# Altium project IOT_BOARD_SIM4G.PrjPcb
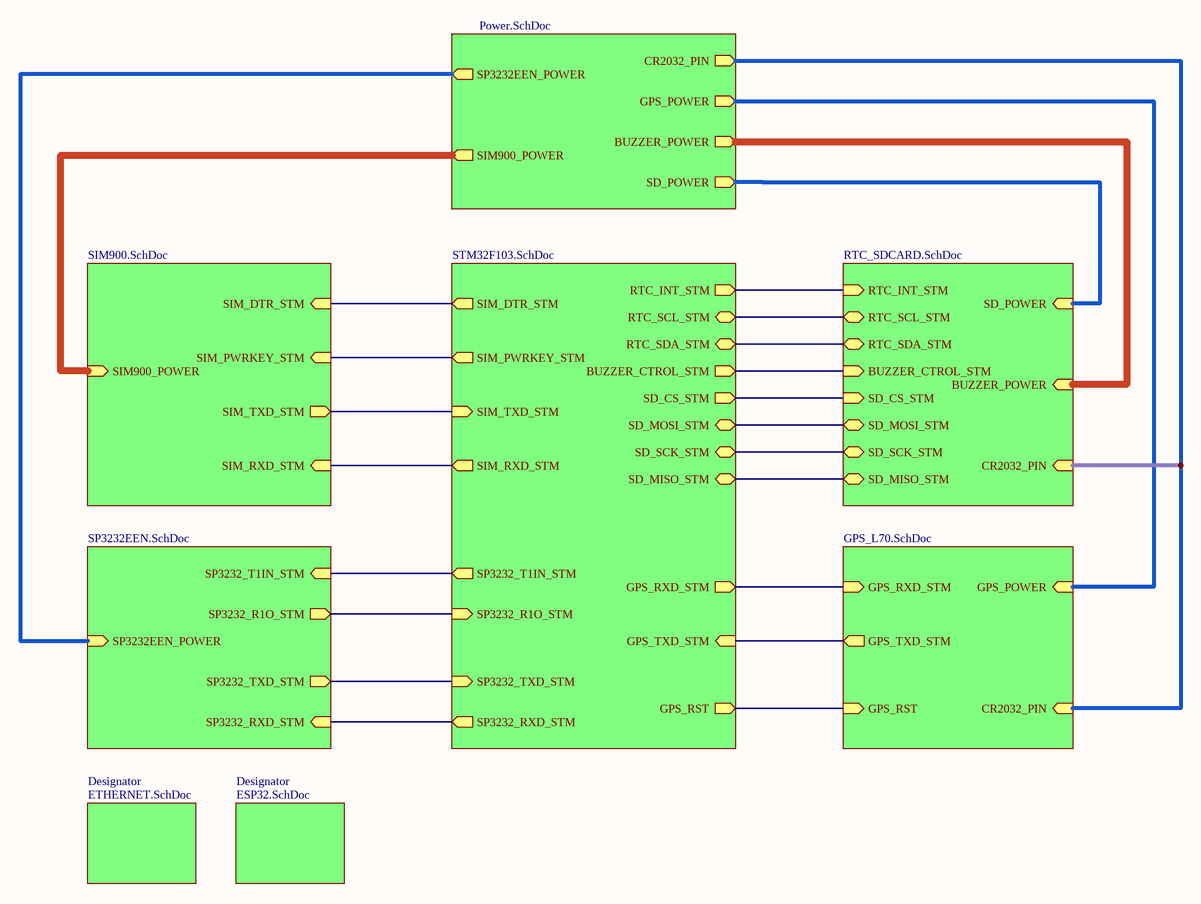
[diagram p0: IOT_4G_BOARD.SchDoc]
9 sheets, 112 parts. Net scope: hierarchical (ports join the sheet entries above them; power ports are global).
Board file: IOT_BOARD_SIM4G.PcbDoc
Sheets:
  IOT_4G_BOARD.SchDoc
    Designator = SIM900.SchDoc
    Designator = SP3232EEN.SchDoc
    Designator = STM32F103.SchDoc
    Designator = RTC_SDCARD.SchDoc
    Designator = GPS_L70.SchDoc
    Designator = Power.SchDoc
    Designator = ETHERNET.SchDoc
    Designator = ESP32.SchDoc

## Sheet IOT_4G_BOARD.SchDoc
size A3; SheetNumber: 1; SheetTotal: 9

### Sub-sheets
Designator = SIM900.SchDoc: SIM900_POWER (in), SIM_RXD_STM (in), SIM_DTR_STM (in), SIM_TXD_STM (out), SIM_PWRKEY_STM (in)
Designator = SP3232EEN.SchDoc: SP3232EEN_POWER (in), SP3232_T1IN_STM (in), SP3232_R1O_STM (out), SP3232_TXD_STM (out), SP3232_RXD_STM (in)
Designator = STM32F103.SchDoc: SIM_RXD_STM (out), SIM_DTR_STM (out), SIM_TXD_STM (in), SP3232_T1IN_STM (out), SP3232_R1O_STM (in), SP3232_TXD_STM (in), SP3232_RXD_STM (out), RTC_SDA_STM (bidir), BUZZER_CTROL_STM (out), SD_CS_STM (out), SD_MOSI_STM (bidir), SD_SCK_STM (bidir), SD_MISO_STM (bidir), RTC_SCL_STM (bidir), RTC_INT_STM (out), GPS_RXD_STM (out), GPS_TXD_STM (in), GPS_RST (out), SIM_PWRKEY_STM (out)
Designator = RTC_SDCARD.SchDoc: CR2032_PIN (in), BUZZER_POWER (in), SD_POWER (in), RTC_SDA_STM (bidir), BUZZER_CTROL_STM (in), SD_CS_STM (in), SD_MOSI_STM (bidir), SD_SCK_STM (bidir), SD_MISO_STM (bidir), RTC_SCL_STM (bidir), RTC_INT_STM (in)
Designator = GPS_L70.SchDoc: GPS_POWER (in), CR2032_PIN (in), GPS_RXD_STM (in), GPS_TXD_STM (out), GPS_RST (in)
Designator = Power.SchDoc: CR2032_PIN (out), GPS_POWER (out), BUZZER_POWER (out), SD_POWER (out), SP3232EEN_POWER (out), SIM900_POWER (out)
Designator = ETHERNET.SchDoc: no entries
Designator = ESP32.SchDoc: no entries

### Nets
POWER: sheet Designator/SP3232EEN_POWER, sheet Designator/SD_POWER, sheet Designator/GPS_POWER, sheet Designator/GPS_POWER, sheet Designator/SD_POWER, sheet Designator/SP3232EEN_POWER
VBAT: sheet Designator/SIM900_POWER, sheet Designator/BUZZER_POWER, sheet Designator/BUZZER_POWER, sheet Designator/SIM900_POWER
9: sheet Designator/SP3232_TXD_STM, sheet Designator/SP3232_TXD_STM
10: sheet Designator/SP3232_RXD_STM, sheet Designator/SP3232_RXD_STM
11: sheet Designator/SP3232_T1IN_STM, sheet Designator/SP3232_T1IN_STM
12: sheet Designator/SP3232_R1O_STM, sheet Designator/SP3232_R1O_STM
NetC23_2: sheet Designator/CR2032_PIN, sheet Designator/CR2032_PIN, sheet Designator/CR2032_PIN
NetM1_3: sheet Designator/SIM_DTR_STM, sheet Designator/SIM_DTR_STM
NetM1_9: sheet Designator/SIM_TXD_STM, sheet Designator/SIM_TXD_STM
NetM1_10: sheet Designator/SIM_RXD_STM, sheet Designator/SIM_RXD_STM
NetMMC1_2: sheet Designator/SD_CS_STM, sheet Designator/SD_CS_STM
NetMMC1_3: sheet Designator/SD_MOSI_STM, sheet Designator/SD_MOSI_STM
NetMMC1_5: sheet Designator/SD_SCK_STM, sheet Designator/SD_SCK_STM
NetMMC1_7: sheet Designator/SD_MISO_STM, sheet Designator/SD_MISO_STM
NetR1_1: sheet Designator/SIM_PWRKEY_STM, sheet Designator/SIM_PWRKEY_STM
NetR15_2: sheet Designator/BUZZER_CTROL_STM, sheet Designator/BUZZER_CTROL_STM
NetR18_1: sheet Designator/GPS_RST, sheet Designator/GPS_RST
NetU3_68: sheet Designator/GPS_RXD_STM, sheet Designator/GPS_RXD_STM
NetU3_69: sheet Designator/GPS_TXD_STM, sheet Designator/GPS_TXD_STM
NetU3_91: sheet Designator/RTC_INT_STM, sheet Designator/RTC_INT_STM
NetU3_92: sheet Designator/RTC_SCL_STM, sheet Designator/RTC_SCL_STM
NetU3_93: sheet Designator/RTC_SDA_STM, sheet Designator/RTC_SDA_STM

## Sheet SIM900.SchDoc
size A; SheetNumber: 2; SheetTotal: 9
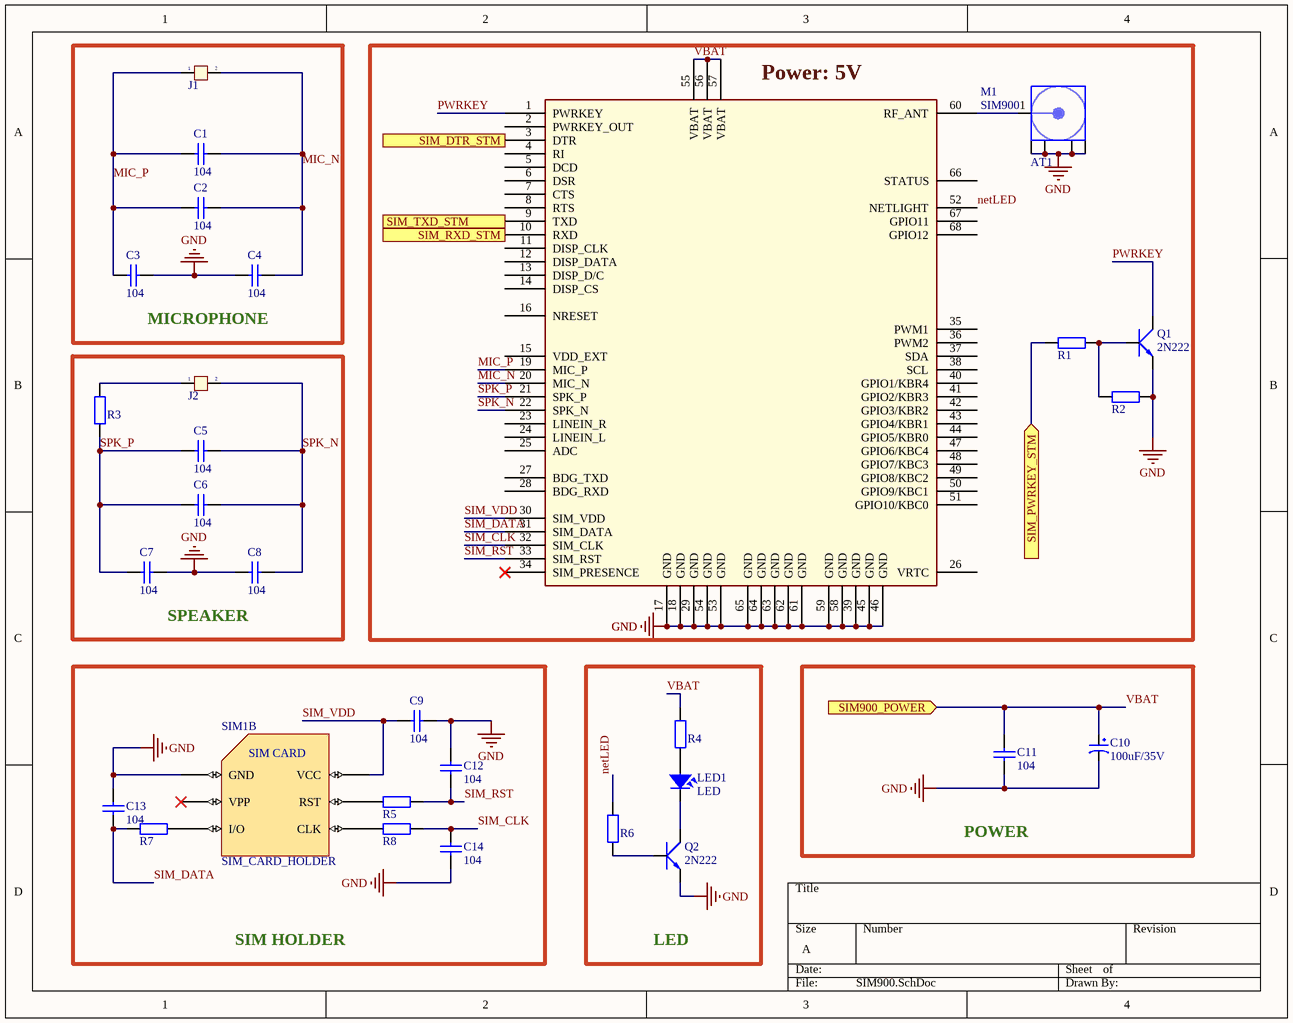
[diagram p1: SIM900.SchDoc]

### Parts
AT1  AT-GSM-GPS  [SNW_H13-L17-SMA]  (value not drawn)
C1  104  [0805]
C2  104  [0805]
C3  104  [0805]
C4  104  [0805]
C5  104  [0805]
C6  104  [0805]
C7  104  [0805]
C8  104  [0805]
C9  104  [0805]
C10  100uF/35V  [CP1.5/3.4]
C11  104  [0805]
C12  104  [0805]
C13  104  [0805]
C14  104  [0805]
J1  Jumper 2  [JP2]  (value not drawn)
J2  Jumper 2  [JP2]  (value not drawn)
LED1  LED  [SM-LED-1206-Green]
M1  SIM900  [SIM900]
Q1  2N222  [SOT23-231]
Q2  2N222  [SOT23-231]
R1  1k  [RES-SMD-0101]  (value not drawn)
R2  1k  [RES-SMD-0101]  (value not drawn)
R3  1k  [RES-SMD-0101]  (value not drawn)
R4  1k  [RES-SMD-0101]  (value not drawn)
R5  1k  [RES-SMD-0101]  (value not drawn)
R6  1k  [RES-SMD-0101]  (value not drawn)
R7  1k  [RES-SMD-0101]  (value not drawn)
R8  1k  [RES-SMD-0101]  (value not drawn)
SIM1  SIM_CARD_HOLDER  [SIM_HOLDER]  (part B of 2)

### Blocks framed on the sheet
MICROPHONE: C1-C4 J1
Power: 5V: AT1 M1 Q1 R1 R2
SPEAKER: C5-C8 J2 R3
SIM HOLDER: C9 C12-C14 R5 R7 R8 SIM1
LED: LED1 Q2 R4 R6
POWER: C10 C11

### Ports
SIM900_POWER (in), SIM_DTR_STM (in), SIM_PWRKEY_STM (in), SIM_RXD_STM (in), SIM_TXD_STM (out)

### Nets
GND: AT1.2 C3.2 C4.2 C7.2 C8.1 C9.1 C10.2 C11.1 C12.1 C13.2 C14.2 M1.17(GND) M1.18(GND) M1.29(GND) M1.39(GND) M1.45(GND) M1.46(GND) M1.53(GND) M1.54(GND) M1.58(GND) M1.59(GND) M1.61(GND) M1.62(GND) M1.63(GND) M1.64(GND) M1.65(GND) Q1.1(E) Q2.1(E) R2.2 SIM1.224(GND)
VBAT: C10.1 C11.2 M1.55(VBAT) M1.56(VBAT) M1.57(VBAT) R4.1 ; port SIM900_POWER
MIC_N: C1.1 C2.1 C4.1 J1.2 M1.20(MIC_N)
MIC_P: C1.2 C2.2 C3.1 J1.1 M1.19(MIC_P)
netLED: M1.52(NETLIGHT) R6.2
PWRKEY: M1.1(PWRKEY) Q1.3(C)
SIM_CLK: C14.1 M1.32(SIM_CLK) R8.1
SIM_DATA: C13.1 M1.31(SIM_DATA) R7.2
SIM_RST: C12.2 M1.33(SIM_RST) R5.1
SIM_VDD: C9.2 M1.30(SIM_VDD) SIM1.227(VCC)
SPK_N: C5.2 C6.2 C8.2 J2.2 M1.22(SPK_N)
SPK_P: C5.1 C6.1 C7.1 M1.21(SPK_P) R3.2
NetAT1_1: AT1.1(Signal) M1.60(RF_ANT)
NetJ2_1: J2.1 R3.1
NetLED1_1: LED1.1 R4.2
NetLED1_2: LED1.2 Q2.3(C)
NetM1_3: M1.3(DTR) ; port SIM_DTR_STM
NetM1_9: M1.9(TXD) ; port SIM_TXD_STM
NetM1_10: M1.10(RXD) ; port SIM_RXD_STM
NetQ1_2: Q1.2(B) R1.2 R2.1
NetQ2_2: Q2.2(B) R6.1
NetR1_1: R1.1 ; port SIM_PWRKEY_STM
NetR5_2: R5.2 SIM1.228(RST)
NetR7_1: R7.1 SIM1.226(I/O)
NetR8_2: R8.2 SIM1.229(CLK)

Not connected (* = marked no-connect by the designer): M1 2(PWRKEY_OUT) 4(RI) 5(DCD) 6(DSR) 7(CTS) 8(RTS) 11(DISP_CLK) 12(DISP_DATA) 13(DISP_D/C) 14(DISP_CS) 15(VDD_EXT) 16(NRESET) 23(LINEIN_R) 24(LINEIN_L) 25(ADC) 26(VRTC) 27(BDG_TXD) 28(BDG_RXD) 34(SIM_PRESENCE)* 35(PWM1) 36(PWM2) 37(SDA) 38(SCL) 40(GPIO1/KBR4) 41(GPIO2/KBR3) 42(GPIO3/KBR2) 43(GPIO4/KBR1) 44(GPIO5/KBR0) 47(GPIO6/KBC4) 48(GPIO7/KBC3) 49(GPIO8/KBC2) 50(GPIO9/KBC1) 51(GPIO10/KBC0) 66(STATUS) 67(GPIO11) 68(GPIO12); SIM1 225(VPP)*

### Notes on the sheet
- (in symbol SIM_CARD_HOLDER, part B) SIM CARD

### Library data of the parts
AT1 = SNW_H13-L17-SMA: CONNECTER ANTENNA GPS GSM; MFR: Sunny Way; Solder: HAND; MPN: SNW_H13-L17-SMA; Value: AT-GSM-GPS
C1-C9 C11-C14 = Cap 104_SMD: Capacitor (Semiconductor SIM Model); Value: 0.1uF; Published: 8-Jun-2000; LatestRevisionDate: 17-Jul-2002; LatestRevisionNote: Re-released for DXP Platform.; PackageReference: C1206; Publisher: Altium Limited
C10 = CP3: Cap 100uF/35V - 470uF/16V; Value: 100uF/35V/50V; Description 1: 1000uF/6,3V - 470uF/16V - 330uF - 25V; Description 2: 220uF/35V - 100uF/50V - 63V - 4,7uF/200V; Description 3: 22uF => 33uF100V - 3,3uF => 4,7uF/250V; Description 4: 2,2uF =>3,3uF/350 - 2,2uF/400V - 1uF/450V
J1 J2 = JP 2: Value: JP 2
M1 = SIM900: Quad-band GSM/GPRS module
Q1 Q2 = 2N222: NPN 600mW, ECB; Value: C1815
R1-R8 = R: Resistor R1/4W

## Sheet SP3232EEN.SchDoc
size A; SheetNumber: 6; SheetTotal: 7
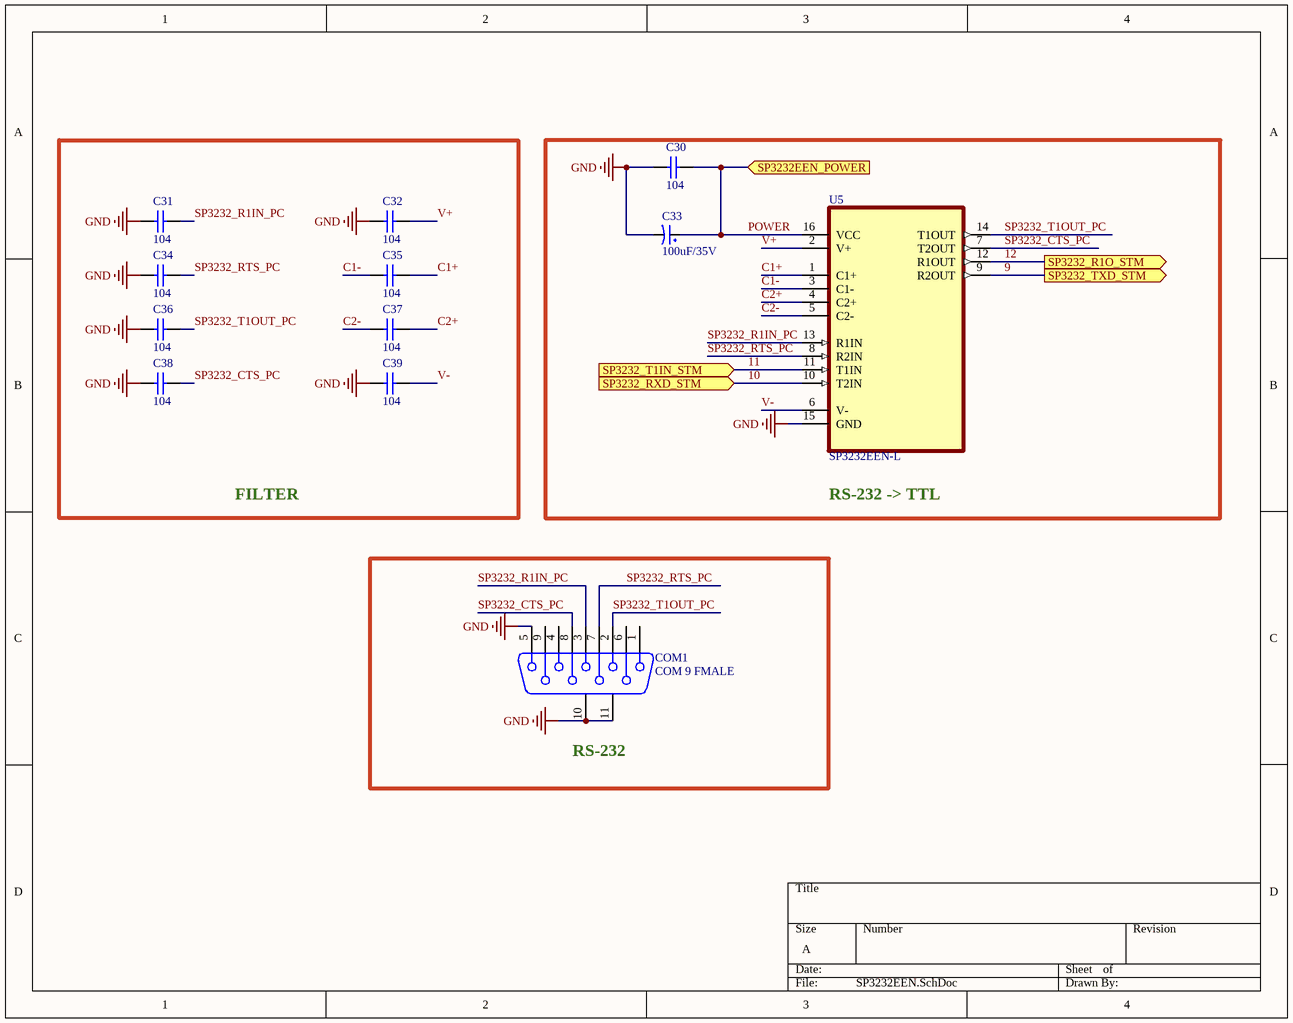
[diagram p2: SP3232EEN.SchDoc]

### Parts
C30  104  [0805]
C31  104  [0805]
C32  104  [0805]
C33  100uF/35V  [CP1.5/3.4]
C34  104  [0805]
C35  104  [0805]
C36  104  [0805]
C37  104  [0805]
C38  104  [0805]
C39  104  [0805]
COM1  COM 9 FMALE  [DSB 9-F]
U5  SP3232EEN-L  [SP3232EEN]

### Blocks framed on the sheet
FILTER: C31 C32 C34-C39
RS-232 -> TTL: C30 C33 U5
RS-232: COM1

### Ports
SP3232_R1O_STM (out), SP3232_RXD_STM (in), SP3232_T1IN_STM (in), SP3232_TXD_STM (out), SP3232EEN_POWER (in)

### Nets
GND: C30.1 C31.1 C32.1 C33.2 C34.1 C36.1 C38.1 C39.1 COM1.5 COM1.10(MH1) COM1.11(MH2) U5.15(GND)
POWER: C30.2 C33.1 U5.16(VCC) ; port SP3232EEN_POWER
9: U5.9(R2OUT) ; port SP3232_TXD_STM
10: U5.10(T2IN) ; port SP3232_RXD_STM
11: U5.11(T1IN) ; port SP3232_T1IN_STM
12: U5.12(R1OUT) ; port SP3232_R1O_STM
C1+: C35.2 U5.1(C1+)
C1-: C35.1 U5.3(C1-)
C2+: C37.2 U5.4(C2+)
C2-: C37.1 U5.5(C2-)
SP3232_CTS_PC: C38.2 COM1.8 U5.7(T2OUT)
SP3232_R1IN_PC: C31.2 COM1.3 U5.13(R1IN)
SP3232_RTS_PC: C34.2 COM1.7 U5.8(R2IN)
SP3232_T1OUT_PC: C36.2 COM1.2 U5.14(T1OUT)
V+: C32.2 U5.2(V+)
V-: C39.2 U5.6(V-)

Not connected (* = marked no-connect by the designer): COM1 1 4 6 9

### Library data of the parts
C30-C32 C34-C39 = Cap 104_SMD: as C1 on sheet SIM900; Published: 8-Jun-2000; LatestRevisionDate: 17-Jul-2002; LatestRevisionNote: Re-released for DXP Platform.; PackageReference: C1206; Publisher: Altium Limited
C33 = CP3: as C10 on sheet SIM900
COM1 = DSB9F: COM 9; PackageDocument: O; Positions: 9; Gender: Receptacle; Value: COM 9; Published: 15-Jun-2001; LatestRevisionDate: 17-Jul-2002; LatestRevisionNote: Re-released for DXP Platform.; DatasheetDocument: 1-Sep-1999; PackageReference: 788750; Publisher: Altium Limited; Orientation: Right Angle
U5 = SP3232EEN-L: 2/2 Transceiver Full RS232 16-SOIC; MF: MaxLinear, Inc.; SnapEDA_Link: https://www.snapeda.com/parts/SP3232EEN-L/MaxLinear,%20Inc./view-part/681175/?ref=snap; Check_prices: https://www.snapeda.com/parts/SP3232EEN-L/MaxLinear,%20Inc./view-part/681175/?ref=eda; MP: SP3232EEN-L; Availability: Warning; Price: None; Value: *; Package: SOIC-16 Exar; Purchase-URL: https://pricing.snapeda.com/search/part/SP3232EEN-L/?ref=eda

## Sheet STM32F103.SchDoc
size A; SheetNumber: 4; SheetTotal: 7
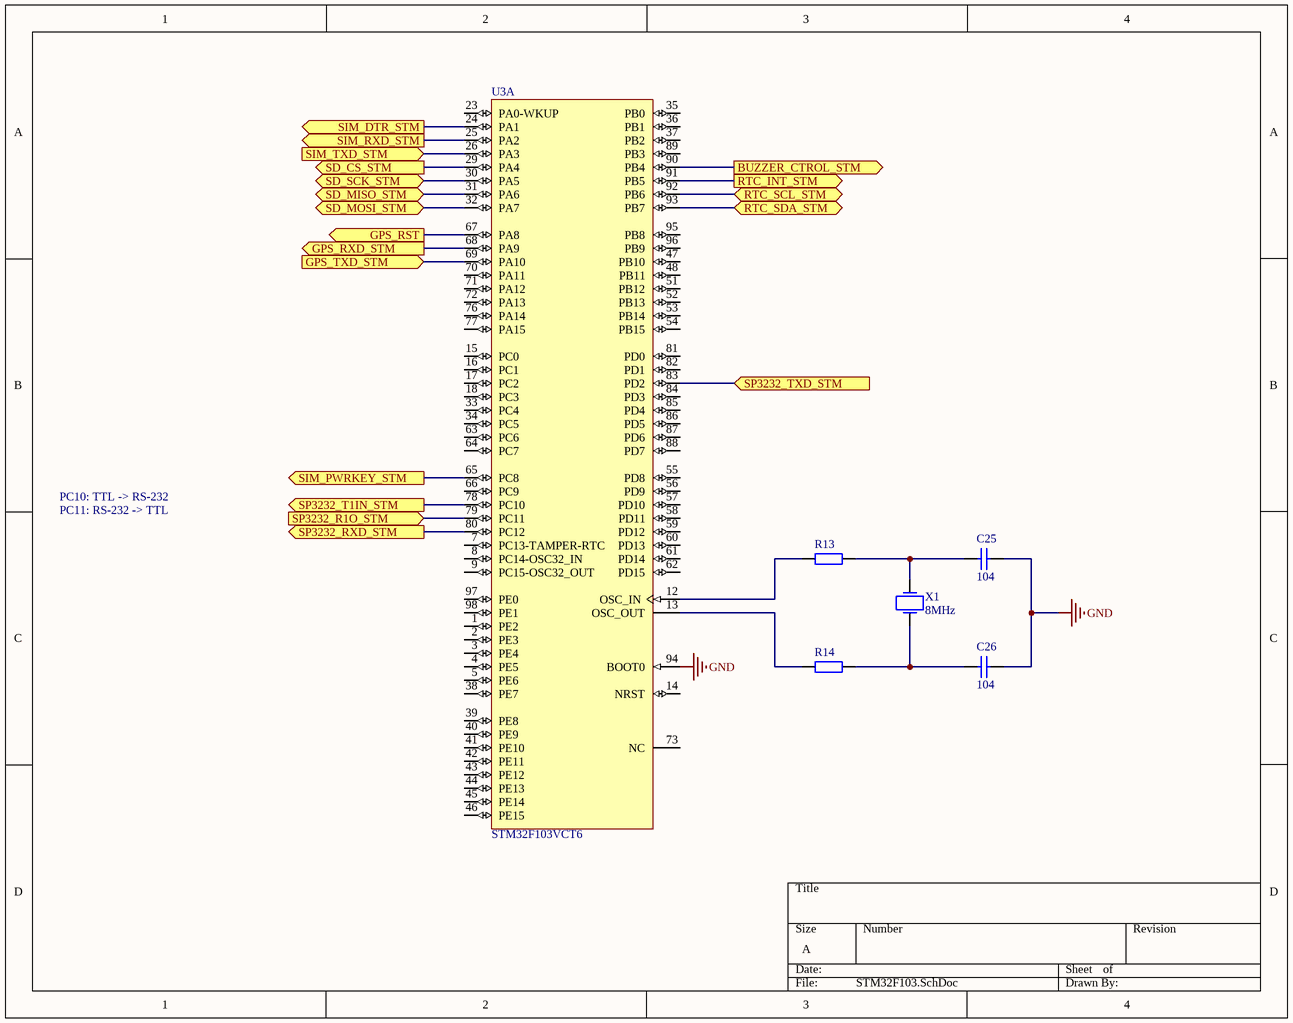
[diagram p3: STM32F103.SchDoc]

### Parts
C25  104  [0805]
C26  104  [0805]
R13  (no value)  [RES-1/4W]
R14  (no value)  [RES-1/4W]
U3  STM32F103VCT6  [STM-LQFP100_M]  (part A of 2)
X1  8MHz  [XTAL_THG_HC49/US]

### Ports
BUZZER_CTROL_STM (out), GPS_RST (out), GPS_RXD_STM (out), GPS_TXD_STM (in), RTC_INT_STM (out), RTC_SCL_STM (bidir), RTC_SDA_STM (bidir), SD_CS_STM (out), SD_MISO_STM (bidir), SD_MOSI_STM (bidir), SD_SCK_STM (bidir), SIM_DTR_STM (out), SIM_PWRKEY_STM (out), SIM_RXD_STM (out), SIM_TXD_STM (in), SP3232_R1O_STM (in), SP3232_RXD_STM (out), SP3232_T1IN_STM (out), SP3232_TXD_STM (in)

### Nets
GND: C25.2 C26.2 U3.94(BOOT0)
9: U3.83(PD2) ; port SP3232_TXD_STM
10: U3.80(PC12) ; port SP3232_RXD_STM
11: U3.78(PC10) ; port SP3232_T1IN_STM
12: U3.79(PC11) ; port SP3232_R1O_STM
NetC25_1: C25.1 R13.1 X1.2(OSC2)
NetC26_1: C26.1 R14.1 X1.1(OSC1)
NetM1_3: U3.24(PA1) ; port SIM_DTR_STM
NetM1_9: U3.26(PA3) ; port SIM_TXD_STM
NetM1_10: U3.25(PA2) ; port SIM_RXD_STM
NetMMC1_2: U3.29(PA4) ; port SD_CS_STM
NetMMC1_3: U3.32(PA7) ; port SD_MOSI_STM
NetMMC1_5: U3.30(PA5) ; port SD_SCK_STM
NetMMC1_7: U3.31(PA6) ; port SD_MISO_STM
NetR1_1: U3.65(PC8) ; port SIM_PWRKEY_STM
NetR13_2: R13.2 U3.12(OSC_IN)
NetR14_2: R14.2 U3.13(OSC_OUT)
NetR15_2: U3.90(PB4) ; port BUZZER_CTROL_STM
NetR18_1: U3.67(PA8) ; port GPS_RST
NetU3_68: U3.68(PA9) ; port GPS_RXD_STM
NetU3_69: U3.69(PA10) ; port GPS_TXD_STM
NetU3_91: U3.91(PB5) ; port RTC_INT_STM
NetU3_92: U3.92(PB6) ; port RTC_SCL_STM
NetU3_93: U3.93(PB7) ; port RTC_SDA_STM

Not connected (* = marked no-connect by the designer): U3 1(PE2) 2(PE3) 3(PE4) 4(PE5) 5(PE6) 7(PC13-TAMPER-RTC) 8(PC14-OSC32_IN) 9(PC15-OSC32_OUT) 14(NRST) 15(PC0) 16(PC1) 17(PC2) 18(PC3) 23(PA0-WKUP) 33(PC4) 34(PC5) 35(PB0) 36(PB1) 37(PB2) 38(PE7) 39(PE8) 40(PE9) 41(PE10) 42(PE11) 43(PE12) 44(PE13) 45(PE14) 46(PE15) 47(PB10) 48(PB11) 51(PB12) 52(PB13) 53(PB14) 54(PB15) 55(PD8) 56(PD9) 57(PD10) 58(PD11) 59(PD12) 60(PD13) 61(PD14) 62(PD15) 63(PC6) 64(PC7) 66(PC9) 70(PA11) 71(PA12) 72(PA13) 73(NC) 76(PA14) 77(PA15) 81(PD0) 82(PD1) 84(PD3) 85(PD4) 86(PD5) 87(PD6) 88(PD7) 89(PB3) 95(PB8) 96(PB9) 97(PE0) 98(PE1)

### Notes on the sheet
- PC10: TTL -> RS-232
- PC11: RS-232 -> TTL

### Library data of the parts
C25 C26 = Cap 104_SMD: as C1 on sheet SIM900; Published: 8-Jun-2000; LatestRevisionDate: 17-Jul-2002; LatestRevisionNote: Re-released for DXP Platform.; PackageReference: C1206; Publisher: Altium Limited
R13 R14 = R: Resistor R1/4W
U3 = STM32F103VCT6: ARM Cortex-M3 32-bit MCU, 256 KB Flash, 48 KB Internal RAM, 80 I/Os, 100-pin LQFP, -40 to 85 degC, Tray; A/D Converter: 3x12-bit (16 Channel); D/A Converter: 2x12-bit (2 Channel); FLASH Size (Prog) (kB): 256; I/Os (High Current): 80; Internal RAM Size (kB): 48; Operating Frequency(F) (Processor speed) (MHz): 72; Supply Voltage(Vcc) min (V): 2; DatasheetVersion: Rev. 8; PackageVersion: Rev. 1, 06/2013; PackageReference: LQFP100; PackageDescription: 100-Pin Low Profile Quad Flat Package, 14 x 14 mm Body, 0.5 mm Pitch; Supplier 1: Digi-Key; Supplier Part Number 1: 497-9034-ND; Supplier 2: Farnell; Supplier Part Number 2: 1624139; Supplier 3: Newark; Supplier Part Number 3: 57P1255; Supplier 4: Mouser; Supplier Part Number 4: 511-STM32F103VCT6; Core: ARM Cortex-M3; Packing: Tray; Mounting Technology: Surface Mount; PartNumber: STM32F103VCT6; ComponentLink1Description: Manufacturer URL; ComponentLink1URL: http://www.st.com/web/en/home.html; ComponentLink2Description: Datasheet; ComponentLink2URL: http://www.st.com/st-web-ui/static/active/en/resource/technical/document/datasheet/CD00191185.pdf; ComponentLink3Description: Package Specification; ComponentLink3URL: http://www.st.com/st-web-ui/static/active/en/resource/technical/document/data_brief/DM00071938.pdf
X1 = XTAL_9B-8.000MAAE-B: CRYSTAL 8.0000MHZ 12PF T/H; Manufacturer: TXC CORPORATION; Frequency Stability: ±30ppm; Operating Mode: Fundamental; Supplier 1: Digi-Key; Manufacturer Part Number: 9B-8.000MAAE-B; RoHS: RoHS Compliant; Category: Crystals, Oscillators, Resonators; Stock 1: 0; Pricing 1: 1000=0.192 (USD); Packaging: Bulk; Part Status: Active; Type: MHz Crystal; Frequency Tolerance: ±30ppm; Load Capacitance: 12pF; Operating Temperature: -20°C ~ 70°C; Ratings: -; Mounting Type: Through Hole; Package / Case: HC49/US; Size / Dimension: 0.453" L x 0.197" W (11.50mm x 5.00mm); Height - Seated (Max): 0.145" (3.68mm); ComponentLink1URL: http://www.txccorp.com/download/products/quartz_crystals/2015TXC_9B_33.pdf; ComponentLink1Description: http://www.txccorp.com/download/products/quartz_crystals/2015TXC_9B_33.pdf; Supplier Part Number 1: 9B-8.000MAAE-B-ND

## Sheet RTC_SDCARD.SchDoc
size A; SheetNumber: 5; SheetTotal: 9
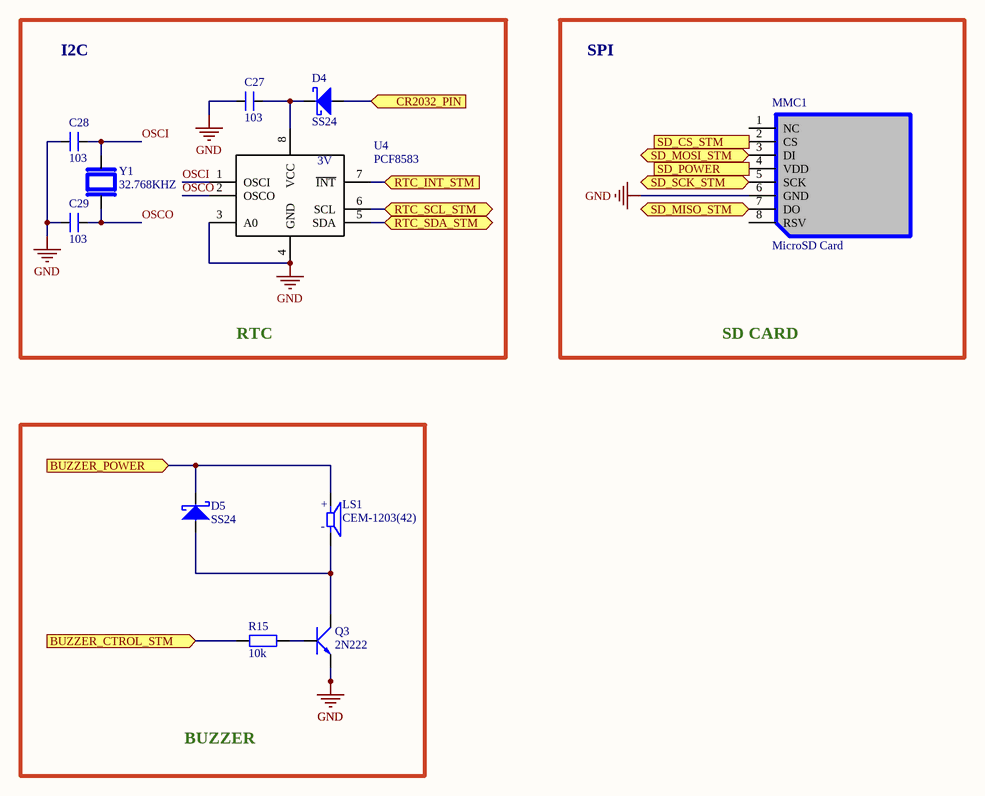
[diagram p4: RTC_SDCARD.SchDoc]

### Parts
C27  103  [SM-0805]
C28  103  [SM-0805]
C29  103  [SM-0805]
D4  SS24  [DIO-SMD-106]
D5  SS24  [DIO-SMD-106]
LS1  CEM-1203(42)  [CUI_CEM-1203(42)]
MMC1  MicroSD Card  [MicroSD-2]
Q3  2N222  [SOT23-231]
R15  10k  [RES-1/4W]
U4  PCF8583  [SO8L]
Y1  32.768KHZ  [XTAL_AB26T-32.768KHZ-E]

### Blocks framed on the sheet
BUZZER: D5 LS1 Q3 R15

### Ports
BUZZER_CTROL_STM (in), BUZZER_POWER (in), CR2032_PIN (in), RTC_INT_STM (in), RTC_SCL_STM (bidir), RTC_SDA_STM (bidir), SD_CS_STM (in), SD_MISO_STM (bidir), SD_MOSI_STM (bidir), SD_POWER (in), SD_SCK_STM (bidir)

### Nets
GND: C27.2 C28.2 C29.1 MMC1.6(GND) Q3.1(E) U4.3(A0) U4.4(GND)
POWER: MMC1.4(VDD) ; port SD_POWER
VBAT: D5.2 LS1.P ; port BUZZER_POWER
OSCI: C28.1 U4.1(OSCI) Y1.1
OSCO: C29.2 U4.2(OSCO) Y1.2
NetC23_2: D4.1 ; port CR2032_PIN
NetC27_1: C27.1 D4.2 U4.8(VCC)
NetD5_1: D5.1 LS1.N Q3.3(C)
NetMMC1_2: MMC1.2(CS) ; port SD_CS_STM
NetMMC1_3: MMC1.3(DI) ; port SD_MOSI_STM
NetMMC1_5: MMC1.5(SCK) ; port SD_SCK_STM
NetMMC1_7: MMC1.7(DO) ; port SD_MISO_STM
NetQ3_2: Q3.2(B) R15.1
NetR15_2: R15.2 ; port BUZZER_CTROL_STM
NetU3_91: U4.7(~{INT}) ; port RTC_INT_STM
NetU3_92: U4.6(SCL) ; port RTC_SCL_STM
NetU3_93: U4.5(SDA) ; port RTC_SDA_STM

Not connected (* = marked no-connect by the designer): MMC1 1(NC) 8(RSV)

### Notes on the sheet
- I2C
- SPI
- (near U4) 3V
- RTC
- SD CARD
- (in symbol CEM-1203(42)) +; -

### Library data of the parts
C27-C29 = CM: Cap SMD; Value: 103
D4 D5 = Diode Schottky: Part Number: LED 3 ly Single Colour; Pricing: *
LS1 = CEM-1203(42): 12 mm, 3.5 V, 85 dB, Through Hole, Magnetic Audio Transducer Buzzer; MF: CUI Devices; Package: None; Price: None; Check_prices: https://www.snapeda.com/parts/CEM-1203(42)/CUI+Devices/view-part/?ref=eda; Value: *; CUI_purchase_URL: https://www.cuidevices.com/product/audio/buzzers/audio-transducers/cem-1203(42)?utm_source=snapeda.com&utm_medium=referral&utm_campaign=snapedaBOM; SnapEDA_Link: https://www.snapeda.com/parts/CEM-1203(42)/CUI+Devices/view-part/?ref=snap; MP: CEM-1203(42); Availability: In Stock; Purchase-URL: https://pricing.snapeda.com/search/part/CEM-1203(42)/?ref=eda
Q3 = 2N222: NPN 600mW, ECB; Value: C1815
R15 = R: Resistor R1/4W
U4 = PCF8583: I2C REAL TIME CLOCK; Manufacturer Part Number: PCF8583T/5,518; Manufacturer: NXP Semiconductors; Time Format: HH:MM:SS (12/24 hr); Memory Size: 240B; Voltage - Supply: 1 V ~ 6 V; Date Format: YY-MM-DD; Interface: I²C, 2-Wire Serial; Supplier 1: Digi-Key; Supplier Part Number 1: 568-1085-2-ND; Supplier: Digi-Key; Supplier Part Number: 568-1085-2-ND; Operating Temperature: -40°C ~ 85°C; Packaging: Tape & Reel (TR); Type: Clock/Calendar/NVSRAM; Package / Case: 8-SOIC (7.5mm Width); Category: Integrated Circuits (ICs); RoHS: RoHS Compliant
Y1 = AB26T-32.768KHZ-E: 32.768kHz WATCH CRYSTAL, 6.2 x 02.1MM CYLINDER PACKAGE; MF: Abracon LLC; Package: Radial Abracon LLC; Price: None; MP: AB26T-32.768KHZ-E; Purchase-URL: https://pricing.snapeda.com/search/part/AB26T-32.768KHZ-E/?ref=eda; Availability: In Stock; Value: *; Check_prices: https://www.snapeda.com/parts/AB26T-32.768KHZ-E/Abracon+LLC/view-part/?ref=eda; SnapEDA_Link: https://www.snapeda.com/parts/AB26T-32.768KHZ-E/Abracon+LLC/view-part/?ref=snap

## Sheet GPS_L70.SchDoc
size A; SheetNumber: 7; SheetTotal: 7
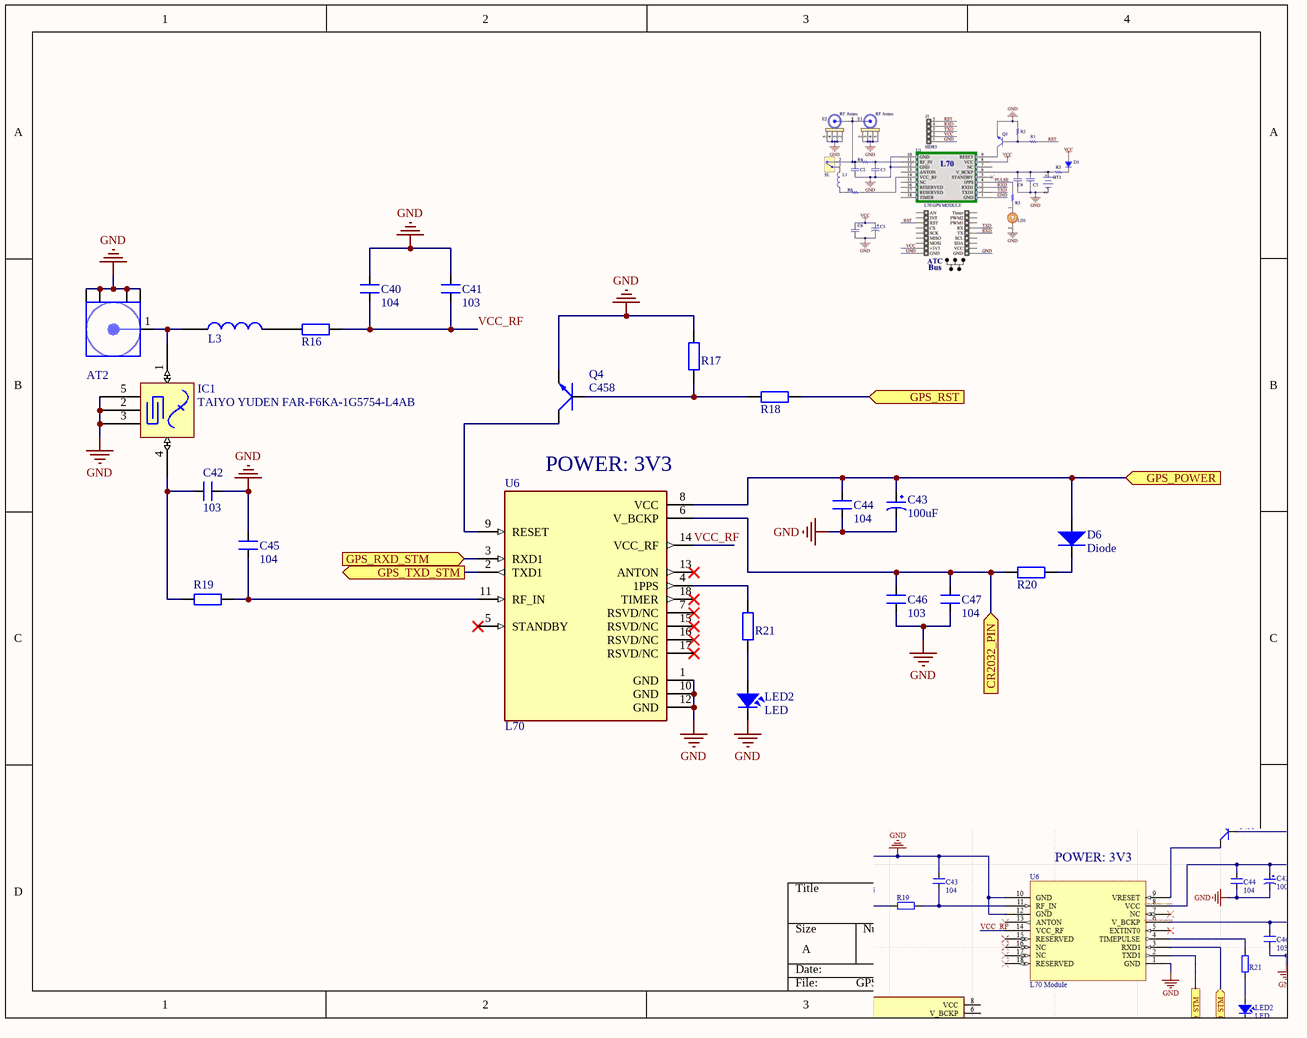
[diagram p5: GPS_L70.SchDoc]

### Parts
AT2  AT-GSM-GPS  [SNW_H13-L17-SMA]  (value not drawn)
C40  104  [CN2]
C41  103  [SM-0805]
C42  103  [SM-0805]
C43  100uF  [CP1/2.5]
C44  104  [CN2]
C45  104  [CN2]
C46  103  [SM-0805]
C47  104  [CN2]
D6  Diode  [DIO-SMD-106]
IC1  TAIYO YUDEN FAR-F6KA-1G5754-L4AB  [TAIYO YUDEN SMD-5 1.4x1mm]
L3  15uH/850mA  [IND-1210 (3225)]  (value not drawn)
LED2  LED  [SM-LED-0805-Blue]
Q4  C458  [SOT23-321]
R16  1k  [RES-SMD-0101]  (value not drawn)
R17  1k  [RES-SMD-0101]  (value not drawn)
R18  1k  [RES-SMD-0101]  (value not drawn)
R19  1k  [RES-SMD-0101]  (value not drawn)
R20  1k  [RES-SMD-0101]  (value not drawn)
R21  1k  [RES-SMD-0101]  (value not drawn)
U6  L70  [XCVR_L70]

### Ports
CR2032_PIN (in), GPS_POWER (in), GPS_RST (in), GPS_RXD_STM (in), GPS_TXD_STM (out)

### Nets
GND: AT2.2 C40.1 C41.2 C42.1 C43.2 C44.1 C45.2 C46.2 C47.1 IC1.2(GND) IC1.3(GND) IC1.5(GND) LED2.2 Q4.1(E) R17.2 U6.1(GND) U6.10(GND) U6.12(GND)
POWER: C43.1 C44.2 D6.1 U6.8(VCC) ; port GPS_POWER
VCC_RF: C40.2 C41.1 R16.2 U6.14(VCC_RF)
NetAT2_1: AT2.1(Signal) IC1.1(IN) L3.1
NetC23_2: C46.1 C47.2 R20.2 U6.6(V_BCKP) ; port CR2032_PIN
NetC42_2: C42.2 IC1.4(OUT) R19.1
NetC45_1: C45.1 R19.2 U6.11(RF_IN)
NetD6_2: D6.2 R20.1
NetL3_2: L3.2 R16.1
NetLED2_1: LED2.1 R21.2
NetQ4_2: Q4.2(C) U6.9(RESET)
NetQ4_3: Q4.3(B) R17.1 R18.2
NetR18_1: R18.1 ; port GPS_RST
NetR21_1: R21.1 U6.4(1PPS)
NetU3_68: U6.3(RXD1) ; port GPS_RXD_STM
NetU3_69: U6.2(TXD1) ; port GPS_TXD_STM

Not connected (* = marked no-connect by the designer): U6 5(STANDBY)* 7(RSVD/NC)* 13(ANTON)* 15(RSVD/NC)* 16(RSVD/NC)* 17(RSVD/NC)* 18(TIMER)*

### Notes on the sheet
- POWER: 3V3

### Library data of the parts
AT2 = SNW_H13-L17-SMA: as AT1 on sheet SIM900; MPN: SNW_H13-L17-SMA; Value: AT-GSM-GPS
C40 C44 C45 C47 = CN2: Cap np 104 => 105pF; Value: 0.1uF
C41 C42 C46 = CM: Cap SMD; Value: 103
C43 = CP2: C 47uF/50V , 220uF/16V; Value: 47uF/16 - 50V; Description 1: 470uF/6,3V - 330uF/10V - 220uF/16V; Description 2: 100uF/25V - 35V - 47uF/50V - 22uF/100V; Description 3: 33uF => 47uF/63V - 1uF => 4,7uF/160V; Description 4: 1uF => 2,2uF/250V - 1uF/350V
IC1 = TAIYO YUDEN FAR-F6KA-1G5754-L4AB: GPS SAW Filter Taiyo Yuden
L3 = CBC3225T150KR: FIXED IND 15UH 850MA 253.5 MOHM; MFR: Taiyo Yuden; Solder: SMT; MPN: CBC3225T150KR; Value: 15uH/850mA; Category: INDUCTOR
Q4 = C458: NPN 600mW, ECB; Value: C1815
R16-R21 = R: Resistor R1/4W
U6 = L70: GPS Module <a href="https://pricing.snapeda.com/parts/L70/Quectel/view-part?ref=eda">Check prices</a> <a href="https://pricing.snapeda.com/parts/L70/Quectel/view-part?ref=eda">Check prices</a>; Availability: Unavailable; Value: *; Package: None; Price: None; MP: L70

## Sheet Power.SchDoc
size A; SheetNumber: 3; SheetTotal: 7
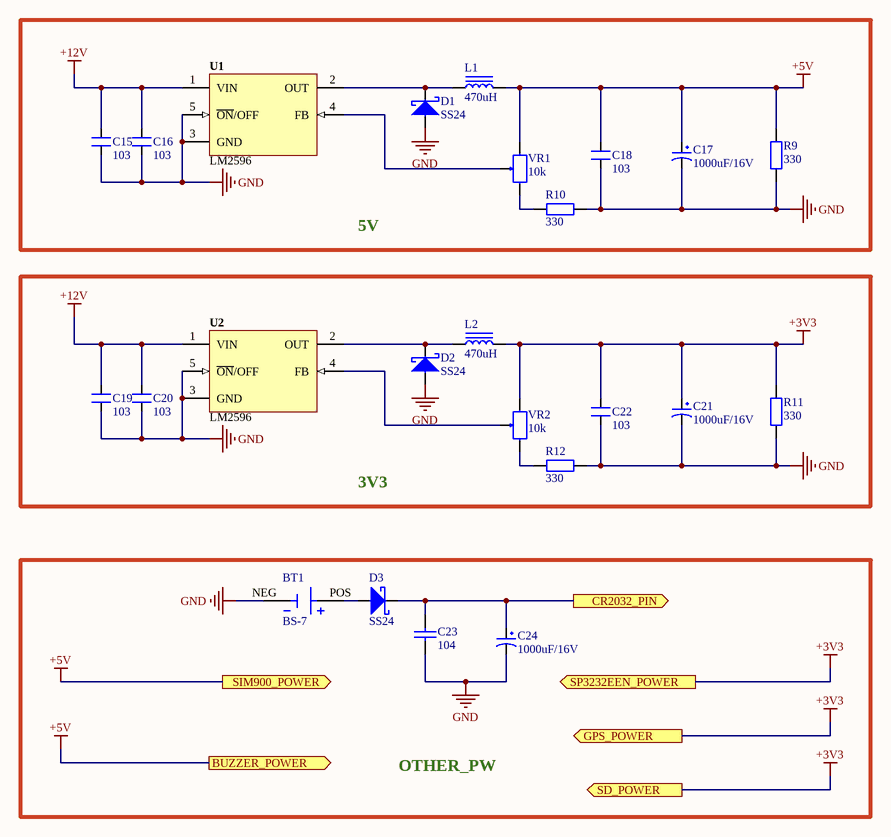
[diagram p6: Power.SchDoc]

### Parts
BT1  BS-7  [BAT_BS-7]
C15  103  [SM-0805]
C16  103  [SM-0603]
C17  1000uF/16V  [CP1.5/3.4]
C18  103  [SM-0603]
C19  103  [SM-0805]
C20  103  [SM-0603]
C21  1000uF/16V  [CP1.5/3.4]
C22  103  [SM-0603]
C23  104  [0805]
C24  1000uF/16V  [CP1.5/3.4]
D1  SS24  [DIO-SMD-106]
D2  SS24  [DIO-SMD-106]
D3  SS24  [DIO-SMD-106]
L1  470uH  [BOURNS SRR1280]
L2  470uH  [BOURNS SRR1280]
R9  330  [RES-1/4W]
R10  330  [RES-1/4W]
R11  330  [RES-1/4W]
R12  330  [RES-1/4W]
U1  LM2596  [TO263]
U2  LM2596  [TO263]
VR1  10k  [VR-S3]
VR2  10k  [VR-S3]

### Blocks framed on the sheet
5V: C15-C18 D1 L1 R9 R10 U1 VR1
3V3: C19-C22 D2 L2 R11 R12 U2 VR2
OTHER_PW: BT1 C23 C24 D3

### Ports
BUZZER_POWER (out), CR2032_PIN (out), GPS_POWER (out), SD_POWER (out), SIM900_POWER (out), SP3232EEN_POWER (out)

### Nets
+3V3: C21.1 C22.2 L2.2 R11.2 VR2.3 ; port SP3232EEN_POWER, port GPS_POWER, port SD_POWER  [project net POWER]
+5V: C17.1 C18.2 L1.2 R9.2 VR1.3 ; port SIM900_POWER, port BUZZER_POWER  [project net VBAT]
+12V: C15.2 C16.2 C19.2 C20.2 U1.1(VIN) U2.1(VIN)
GND: BT1.NEG C15.1 C16.1 C17.2 C18.1 C19.1 C20.1 C21.2 C22.1 C23.1 C24.2 D1.1 D2.1 R9.1 R10.1 R11.1 R12.1 U1.3(GND) U1.5(~{ON}/OFF) U2.3(GND) U2.5(~{ON}/OFF)
NetBT1_POS: BT1.POS D3.1
NetC23_2: C23.2 C24.1 D3.2 ; port CR2032_PIN
NetD1_2: D1.2 L1.1 U1.2(OUT)
NetD2_2: D2.2 L2.1 U2.2(OUT)
NetR10_2: R10.2 VR1.1
NetR12_2: R12.2 VR2.1
NetU1_4: U1.4(FB) VR1.2
NetU2_4: U2.4(FB) VR2.2

### Library data of the parts
BT1 = BS-7: Battery Holder (Open) Coin, 20.0mm 1 Cell PC Pin; MF: MPD (Memory; SnapEDA_Link: https://www.snapeda.com/parts/BS-7/MPD+%2528Memory+Protection+Devices%2529/view-part/?ref=snap; Package: None; MP: BS-7; Check_prices: https://www.snapeda.com/parts/BS-7/MPD+%2528Memory+Protection+Devices%2529/view-part/?ref=eda; Purchase-URL: https://pricing.snapeda.com/search/part/BS-7/?ref=eda; Digi-Key_Part_Number: BS-7-ND; Value: *
C15 C16 C18-C20 C22 = CM: Cap SMD; Value: 103
C17 C21 C24 = CP4: Cap 1000uF/16V - 220uF/50V; Description 5: 4,7uF>10uF/250V_3,3uF>10uF/400V - 2,2uF>4,7uF/450V; Description 1: 2200uF-3300uF/6,3V - 1000uF-2200uF/10V; Description 2: 1000uF/16V - 470uF => 1000uF/25V - 100uF/100V; Description 3: 330uF>470uF/35V_220uF>470uF/50V_10uF>22uF/250V; Description 4: 220uF => 330uF/63V - 10uF =>33uF/160 - 200V; Value: 1000uF/16V
C23 = Cap 104_SMD: as C1 on sheet SIM900; Published: 8-Jun-2000; LatestRevisionDate: 17-Jul-2002; LatestRevisionNote: Re-released for DXP Platform.; PackageReference: C1206; Publisher: Altium Limited
D1-D3 = Diode Schottky: Part Number: LED 3 ly Single Colour; Pricing: *
L1 L2 = Inductor: SMT Inductor; Value: 1.5uH
R9-R12 = R: Resistor R1/4W
U1 U2 = LM2596: Max Input Voltage: 12 V; Max Output Current: 3 (6.0 peak) A; Max Output Voltage: mV; Category: IC-Power; Min Input Voltage: mV; Min Output Voltage: mV; Mounting Technology: Surface Mount; Status: Unreleased; Supply Voltage: mV; Temperature Range: -40 to +125 degC
VR1 VR2 = Resistor Var

## Sheet ETHERNET.SchDoc
size A4; SheetNumber: 8; SheetTotal: 9
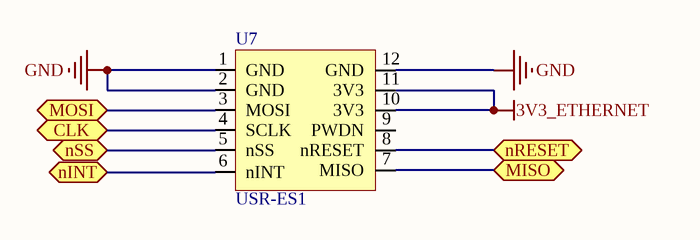
[diagram p7: ETHERNET.SchDoc]

### Parts
U7  USR-ES1  [USR-ES1]

### Ports
CLK (bidir), MISO (bidir), MOSI (bidir), nINT (bidir), nRESET (bidir), nSS (bidir)

### Nets
3V3_ETHERNET: U7.10(3V3) U7.11(3V3)
GND: U7.1(GND) U7.2(GND) U7.12(GND)
NetU7_3: U7.3(MOSI) ; port MOSI
NetU7_4: U7.4(SCLK) ; port CLK
NetU7_5: U7.5(nSS) ; port nSS
NetU7_6: U7.6(nINT) ; port nINT
NetU7_7: U7.7(MISO) ; port MISO
NetU7_8: U7.8(nRESET) ; port nRESET

Not connected (* = marked no-connect by the designer): U7 9(PWDN)

### Library data of the parts
U7 = USR-ES1: Ethernet module

## Sheet ESP32.SchDoc
size A4; SheetNumber: 9; SheetTotal: 9
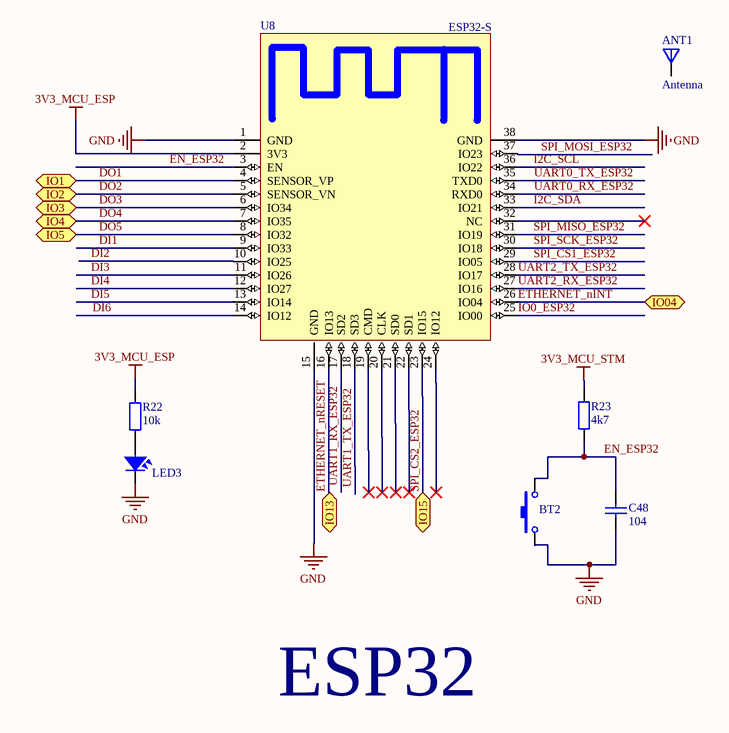
[diagram p8: ESP32.SchDoc]

### Parts
ANT1  Antenna  [ANTENNA]
BT2  SW  [BUTTON RIGHT ANGLE]  (value not drawn)
C48  104  [0603_Cap]
LED3  LED  [0603_LED]  (value not drawn)
R22  10k  [0603_Res]
R23  4k7  [0603_Res]
U8  ESP32-S  [ESP32-S]

### Ports
IO1 (bidir), IO2 (bidir), IO3 (bidir), IO04 (bidir), IO4 (bidir), IO5 (bidir), IO13 (bidir), IO15 (bidir)

### Nets
3V3_MCU_ESP: R22.2 U8.2(3V3)
3V3_MCU_STM: R23.2
GND: BT2.1 C48.1 LED3.C(Cathode) U8.1(GND) U8.15(GND) U8.38(GND)
DI1: U8.9(IO33)
DI2: U8.10(IO25)
DI3: U8.11(IO26)
DI4: U8.12(IO27)
DI5: U8.13(IO14)
DI6: U8.14(IO12)
DO1: U8.4(SENSOR_VP) ; port IO1
DO2: U8.5(SENSOR_VN) ; port IO2
DO3: U8.6(IO34) ; port IO3
DO4: U8.7(IO35) ; port IO4
DO5: U8.8(IO32) ; port IO5
EN_ESP32: BT2.2 C48.2 R23.1 U8.3(EN)
ETHERNET_nINT: U8.26(IO04) ; port IO04
ETHERNET_nRESET: U8.16(IO13) ; port IO13
I2C_SCL: U8.36(IO22)
I2C_SDA: U8.33(IO21)
IO0_ESP32: U8.25(IO00)
SPI_CS1_ESP32: U8.29(IO05)
SPI_CS2_ESP32: U8.23(IO15) ; port IO15
SPI_MISO_ESP32: U8.31(IO19)
SPI_MOSI_ESP32: U8.37(IO23)
SPI_SCK_ESP32: U8.30(IO18)
UART0_RX_ESP32: U8.34(RXD0)
UART0_TX_ESP32: U8.35(TXD0)
UART1_RX_ESP32: U8.17(SD2)
UART1_TX_ESP32: U8.18(SD3)
UART2_RX_ESP32: U8.27(IO16)
UART2_TX_ESP32: U8.28(IO17)
NetLED3_A: LED3.A(Anode) R22.1

Not connected (* = marked no-connect by the designer): ANT1 1(ANT); U8 19(CMD)* 20(CLK)* 21(SD0)* 22(SD1)* 24(IO12)* 32(NC)*

### Notes on the sheet
- ESP32

### Library data of the parts
BT2 = SW-Button: Switch-Button; Published: 24-Mar-1999; LatestRevisionDate: 17-Jul-2002; LatestRevisionNote: Re-released for DXP Platform.; PackageReference: SPST-2; Publisher: Altium Limited
C48 = Ceramic Capacitor: Chung_Loai: Dán; Don_Vi: Con; So_Chan: 2; Ten_Linh_Kien: Tụ 0805 104-100nF 10% 50V; Ma_Hang: MH004551; Kieu_Chan: *
LED3 = LED: LED single color 2 leads
R22 R23 = Resistor: Chung_Loai: Dán; Don_Vi: Con; So_Chan: 2; Ten_Linh_Kien: Trở 0805 1% 1k; Ma_Hang: MH005468; Kieu_Chan: *

## Nets that join several sheets
GND: SIM900 (30 pins), SP3232EEN (12 pins), STM32F103 (C25.2 C26.2 U3.94), RTC_SDCARD (7 pins), GPS_L70 (18 pins), Power (21 pins), ETHERNET (U7.1 U7.2 U7.12), ESP32 (6 pins)
POWER: SP3232EEN (C30.2 C33.1 U5.16), RTC_SDCARD (MMC1.4), GPS_L70 (C43.1 C44.2 D6.1 U6.8), Power (5 pins)
VBAT: SIM900 (6 pins), RTC_SDCARD (D5.2 LS1.P), Power (5 pins)
9: SP3232EEN (U5.9), STM32F103 (U3.83)
10: SP3232EEN (U5.10), STM32F103 (U3.80)
11: SP3232EEN (U5.11), STM32F103 (U3.78)
12: SP3232EEN (U5.12), STM32F103 (U3.79)
NetC23_2: RTC_SDCARD (D4.1), GPS_L70 (C46.1 C47.2 R20.2 U6.6), Power (C23.2 C24.1 D3.2)
NetM1_3: SIM900 (M1.3), STM32F103 (U3.24)
NetM1_9: SIM900 (M1.9), STM32F103 (U3.26)
NetM1_10: SIM900 (M1.10), STM32F103 (U3.25)
NetMMC1_2: STM32F103 (U3.29), RTC_SDCARD (MMC1.2)
NetMMC1_3: STM32F103 (U3.32), RTC_SDCARD (MMC1.3)
NetMMC1_5: STM32F103 (U3.30), RTC_SDCARD (MMC1.5)
NetMMC1_7: STM32F103 (U3.31), RTC_SDCARD (MMC1.7)
NetR1_1: SIM900 (R1.1), STM32F103 (U3.65)
NetR15_2: STM32F103 (U3.90), RTC_SDCARD (R15.2)
NetR18_1: STM32F103 (U3.67), GPS_L70 (R18.1)
NetU3_68: STM32F103 (U3.68), GPS_L70 (U6.3)
NetU3_69: STM32F103 (U3.69), GPS_L70 (U6.2)
NetU3_91: STM32F103 (U3.91), RTC_SDCARD (U4.7)
NetU3_92: STM32F103 (U3.92), RTC_SDCARD (U4.6)
NetU3_93: STM32F103 (U3.93), RTC_SDCARD (U4.5)